# Altium schematic sheet IsoDiffProbe.SchDoc: Isolated Differential Probe
size A3; Engineer: Michael; Revision: A; SheetNumber: 1; SheetTotal: 1
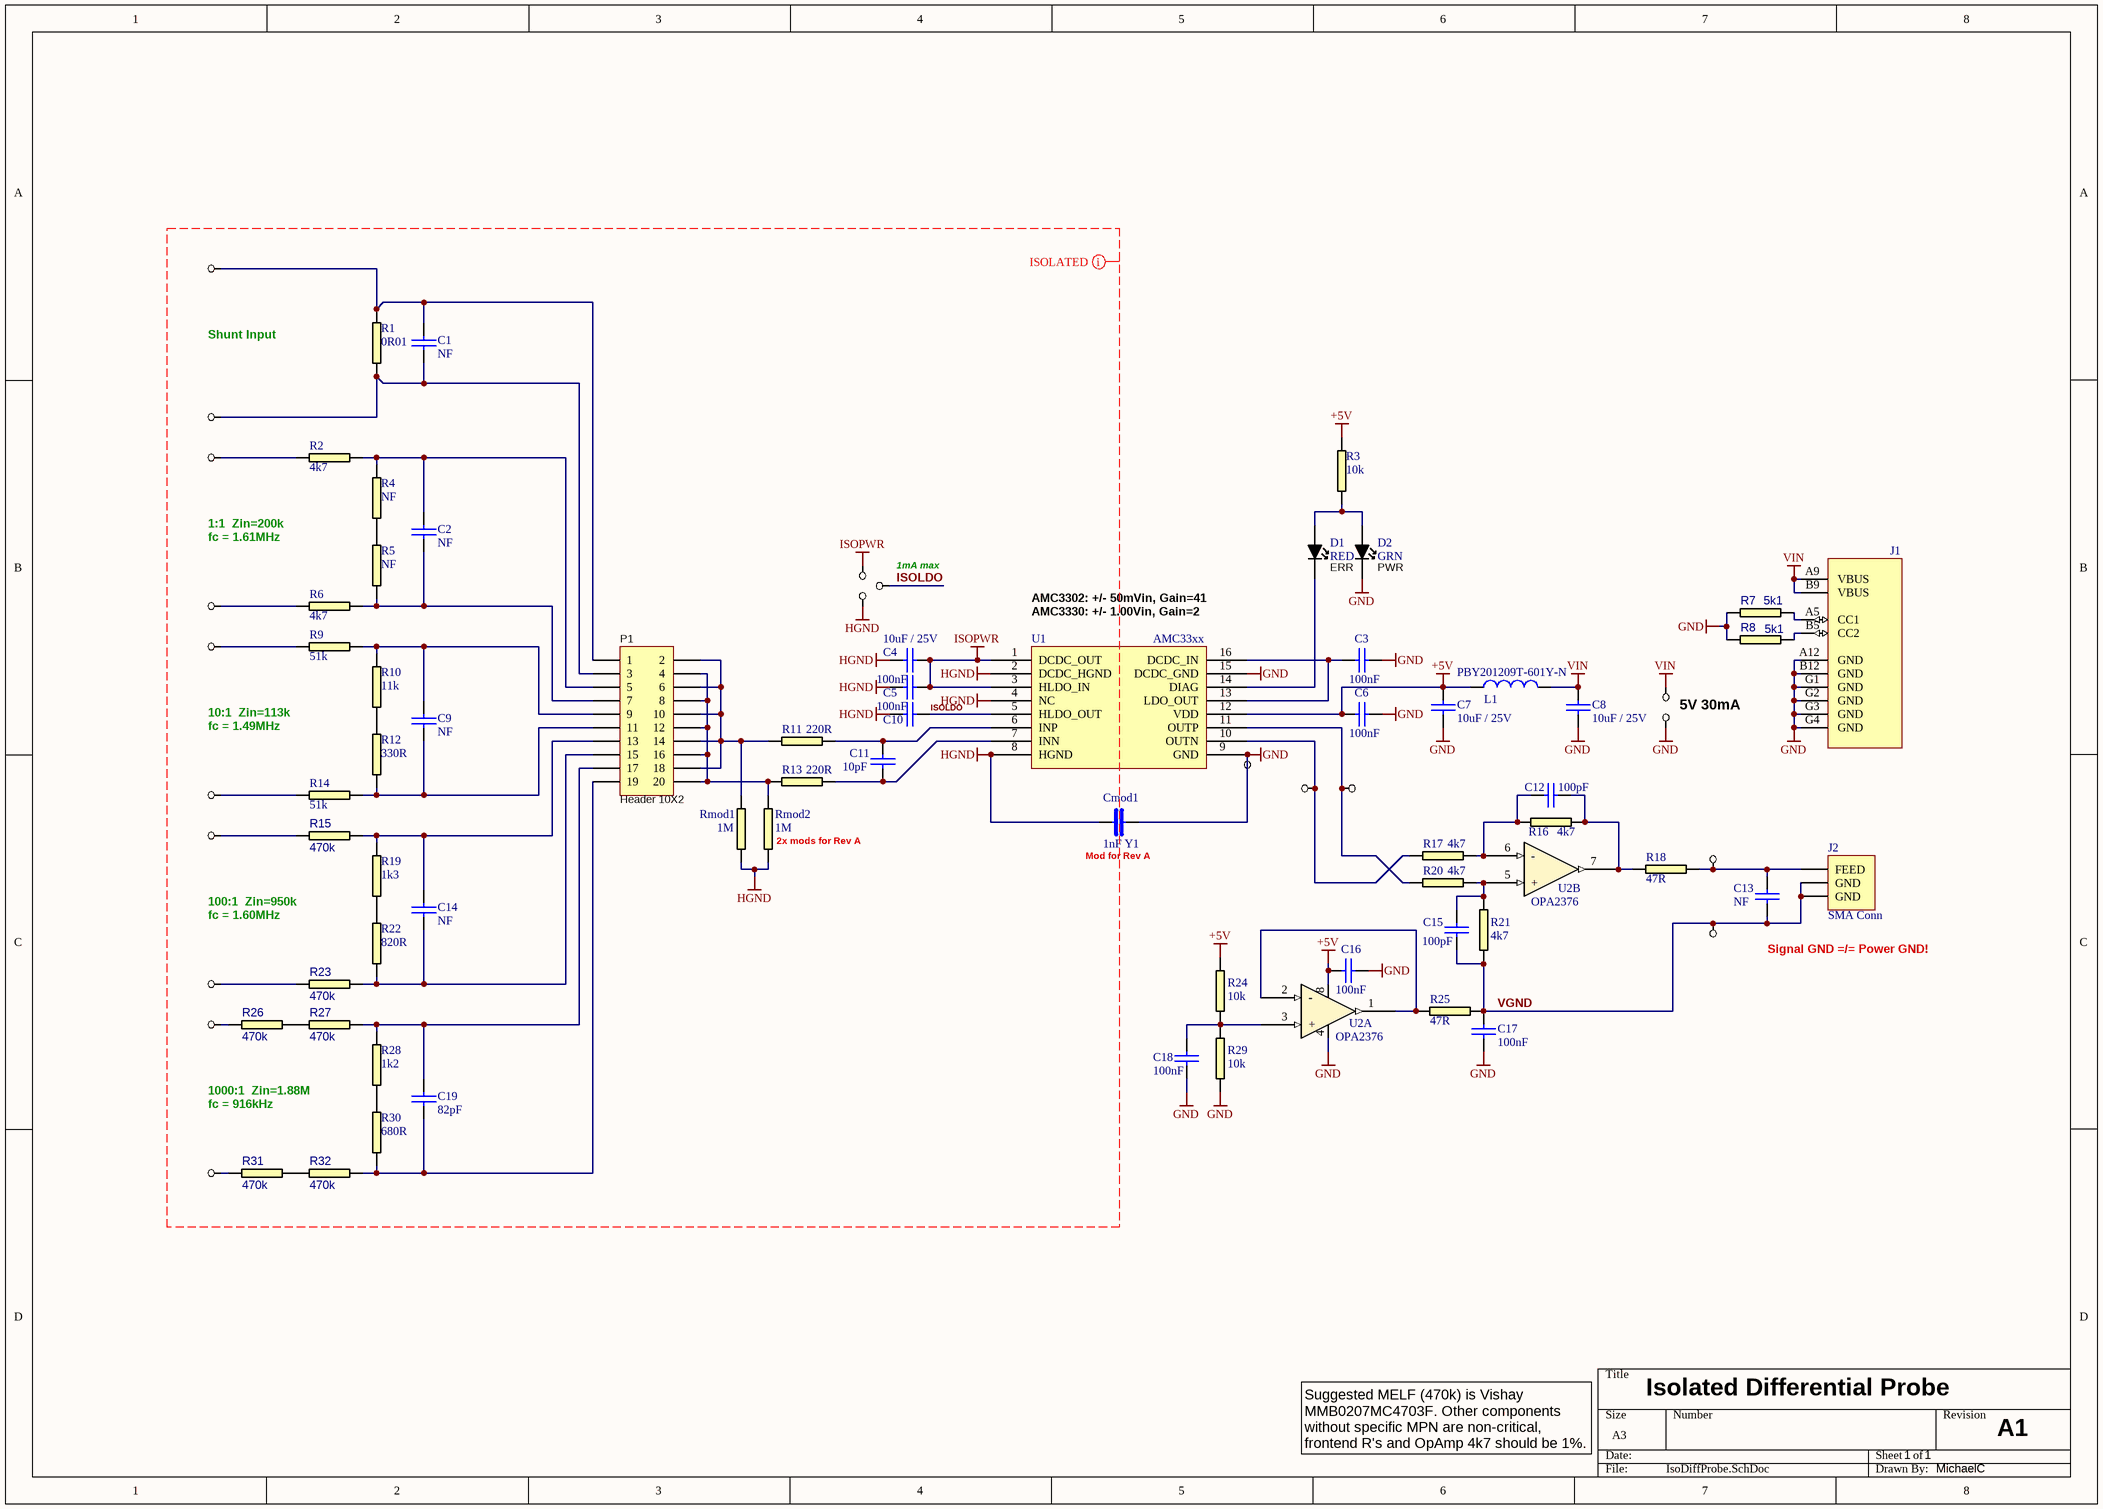
[diagram p0: IsoDiffProbe.SchDoc]

## Parts
C1  NF  [0603]
C2  NF  [0603]
C3  100nF  [0603]
C4  10uF / 25V  [0805_cap_Rounded]
C5  100nF  [0603]
C6  100nF  [0603]
C7  10uF / 25V  [0805_cap_Rounded]
C8  10uF / 25V  [0805_cap_Rounded]
C9  NF  [0603]
C10  100nF  [0603]
C11  10pF  [0603]
C12  100pF  [0603]
C13  NF  [0603]
C14  NF  [0603]
C15  100pF  [0603]
C16  100nF  [0603]
C17  100nF  [0603]
C18  100nF  [0603]
C19  82pF  [0603]
Cmod1  1nF Y1  [RAD0.4Y1]
D1  RED  [LED-0603]
D2  GRN  [LED-0603]
J1  USB C 6-Pin  [USB-C_6pin_Conn]  (value not drawn)
J2  SMA Conn  [SMA_SMD]
L1  PBY201209T-601Y-N  [0805_Rounded]
P1  Header 10X2  [IDC20]
R1  0R01  [1206]
R2  4k7  [1206]
R3  10k  [0603]
R4  NF  [0603]
R5  NF  [0603]
R6  4k7  [1206]
R7  5k1  [0603]
R8  5k1  [0603]
R9  51k  [1206]
R10  11k  [0603]
R11  220R  [0603]
R12  330R  [0603]
R13  220R  [0603]
R14  51k  [1206]
R15  470k  [MMB0207]
R16  4k7  [0603]
R17  4k7  [0603]
R18  47R  [0603]
R19  1k3  [0603]
R20  4k7  [0603]
R21  4k7  [0603]
R22  820R  [0603]
R23  470k  [MMB0207]
R24  10k  [0603]
R25  47R  [0603]
R26  470k  [MMB0207]
R27  470k  [MMB0207]
R28  1k2  [0603]
R29  10k  [0603]
R30  680R  [0603]
R31  470k  [MMB0207]
R32  470k  [MMB0207]
Rmod1  1M  [0603]
Rmod2  1M  [0603]
TP1  Test Point  [TP]  (value not drawn)
TP2  Test Point  [TP]  (value not drawn)
TP3  Test Point  [TP]  (value not drawn)
TP4  Test Point  [TP]  (value not drawn)
TP5  Test Point  [TP]  (value not drawn)
TP6  Test Point  [TP]  (value not drawn)
TP7  Test Point  [TP]  (value not drawn)
TP8  Test Point  [TP]  (value not drawn)
TP9  Test Point  [TP]  (value not drawn)
TP10  Test Point  [TP]  (value not drawn)
TP11  Test Point  [TP]  (value not drawn)
TP12  Test Point  [TP]  (value not drawn)
TP13  Test Point  [TP]  (value not drawn)
TP14  Test Point  [TP]  (value not drawn)
TP15  Test Point  [TP]  (value not drawn)
TP16  Test Point  [TP]  (value not drawn)
TP17  Test Point  [TP]  (value not drawn)
TP18  Test Point  [TP]  (value not drawn)
TP19  Test Point  [TP]  (value not drawn)
TP20  Test Point  [TP]  (value not drawn)
U1  AMC33xx  [DW0016B]
U2  OPA2376  [SO-8]  (parts A,B of 2)

## Nets
+5V: C6.2 C7.1 C16.1 L1.1 R3.2 R24.1 U1.12(VDD) U2.8(VDD)
GND: C3.1 C6.1 C7.2 C8.2 C16.2 C17.2 C18.2 Cmod1.2 D2.K J1.A12(GND) J1.B12(GND) J1.G1(GND) J1.G2(GND) J1.G3(GND) J1.G4(GND) R7.1 R8.1 R29.2 TP7.1 TP19.1 U1.9(GND) U1.15(DCDC_GND) U2.4(GND)
HGND: C4.1 C5.2 C10.2 Cmod1.1 Rmod1.2 Rmod2.2 TP18.1 U1.2(DCDC_HGND) U1.4(NC) U1.8(HGND)
ISOPWR: C4.2 C5.1 TP17.1 U1.1(DCDC_OUT) U1.3(HLDO_IN)
VIN: C8.1 J1.A9(VBUS) J1.B9(VBUS) L1.2 TP6.1
ISOLDO: C10.1 TP20.1 U1.5(HLDO_OUT)
VGND: C13.2 C15.2 C17.1 J2.GND R21.2 R25.1 TP16.1
NetC1_1: C1.1 P1.1 R1.2 TP1.1
NetC1_2: C1.2 P1.3 R1.1 TP2.1
NetC2_1: C2.1 P1.5 R2.2 R4.1
NetC2_2: C2.2 P1.7 R5.2 R6.2
NetC3_2: C3.2 U1.13(LDO_OUT) U1.16(DCDC_IN)
NetC9_1: C9.1 P1.9 R9.2 R10.1
NetC9_2: C9.2 P1.11 R12.2 R14.2
NetC11_1: C11.1 R11.1 U1.6(INP)
NetC11_2: C11.2 R13.1 U1.7(INN)
NetC12_1: C12.1 R16.1 R17.1 U2.6(-)
NetC12_2: C12.2 R16.2 R18.2 U2.7(2OUT)
NetC13_1: C13.1 J2.FEED R18.1 TP15.1
NetC14_1: C14.1 P1.13 R15.2 R19.1
NetC14_2: C14.2 P1.15 R22.2 R23.2
NetC15_1: C15.1 R20.1 R21.1 U2.5(+)
NetC18_1: C18.1 R24.2 R29.1 U2.3(+)
NetC19_1: C19.1 P1.17 R27.2 R28.1
NetC19_2: C19.2 P1.19 R30.2 R32.2
NetD1_A: D1.A D2.A R3.1
NetD1_K: D1.K U1.14(DIAG)
NetJ1_A5: J1.A5(CC1) R7.2
NetJ1_B5: J1.B5(CC2) R8.2
NetP1_2: P1.2 P1.6 P1.10 P1.14 P1.18 R11.2 Rmod1.1
NetP1_4: P1.4 P1.8 P1.12 P1.16 P1.20 R13.2 Rmod2.1
NetR2_1: R2.1 TP3.1
NetR4_2: R4.2 R5.1
NetR6_1: R6.1 TP4.1
NetR9_1: R9.1 TP5.1
NetR10_2: R10.2 R12.1
NetR14_1: R14.1 TP8.1
NetR15_1: R15.1 TP9.1
NetR17_2: R17.2 TP13.1 U1.10(OUTN)
NetR19_2: R19.2 R22.1
NetR20_2: R20.2 TP14.1 U1.11(OUTP)
NetR23_1: R23.1 TP10.1
NetR25_2: R25.2 U2.1(1OUT) U2.2(-)
NetR26_1: R26.1 TP11.1
NetR26_2: R26.2 R27.1
NetR28_2: R28.2 R30.1
NetR31_1: R31.1 TP12.1
NetR31_2: R31.2 R32.1

## Layout directives
net class ISOLATED: HGND, ISOLDO, ISOPWR

## Notes on the sheet
- Shunt Input
- 1:1  Zin=200k
- fc = 1.61MHz
- 1mA max
- ERR
- (near D2) PWR
- AMC3302: +/- 50mVin, Gain=41
- (near U1) AMC3330: +/- 1.00Vin, Gain=2
- 10:1  Zin=113k
- 5V 30mA
- fc = 1.49MHz
- (near Rmod2) 2x mods for Rev A
- (near Cmod1) Mod for Rev A
- 100:1  Zin=950k
- fc = 1.60MHz
- Signal GND =/= Power GND!
- 1000:1  Zin=1.88M
- fc = 916kHz
- Isolated Differential Probe
- Suggested MELF (470k) is Vishay MMB0207MC4703F. Other components without specific MPN are non-critical, frontend R's and OpAmp 4k7 should be 1%.
- 1    1
- A1
- MichaelC
- Size:
- Date:
- A3
- Engineer:
- Time:
- Revision:
- Sheet
- of
- 38 Connors Street
- Petrie
- Queensalnd
- Australia 4502
- NIXlabs
- ABN 78 110 308 432
- File:

## Library data of the parts
C1-C19 = CAP-STD-SM: Capacitor - S/M
Cmod1 = CAP-STD-TH: Capacitor - Through Hole
D1 D2 = LED
J1 = USB-C_6pin: USB Type C Receptacle Power Only (6 pin)
J2 = SMA_SMD: SMA connector, mid-mount
L1 = 742792651: Ferrite Bead WE-CBF, Z = 600 Ohm
P1 = Header 10X2: Header, 10-Pin, Dual row
R1-R6 R9-R14 R16-R22 R24 R25 R28-R30 Rmod1 Rmod2 = RES-SM: Resistor - S/M
R7 R8 R15 R23 R26 R27 R31 R32 = ResSMD: Resistor SMD
TP1-TP20 = TP: Pad for Test Point
U1 = AMC330X: Isolated differential analog sensor
U2 = TLC272ID: PRECISION DUAL OPERATIONAL AMPLIFIER